# Altium schematic sheet Digital Isolator.SchDoc
size A3; Date: 27.05.2014; DrawnBy: luths8; Organization: BFH; Address1: Bern University of Applied Sciences; Address2: Engineering and Information Technology; Address3: Jlcoweg 1; Address4: CH-3400 Burgdorf; DocumentNumber: 1; Revision: 1.0; SheetNumber: 16; SheetTotal: 17; CurrentDate: 27.05.2014
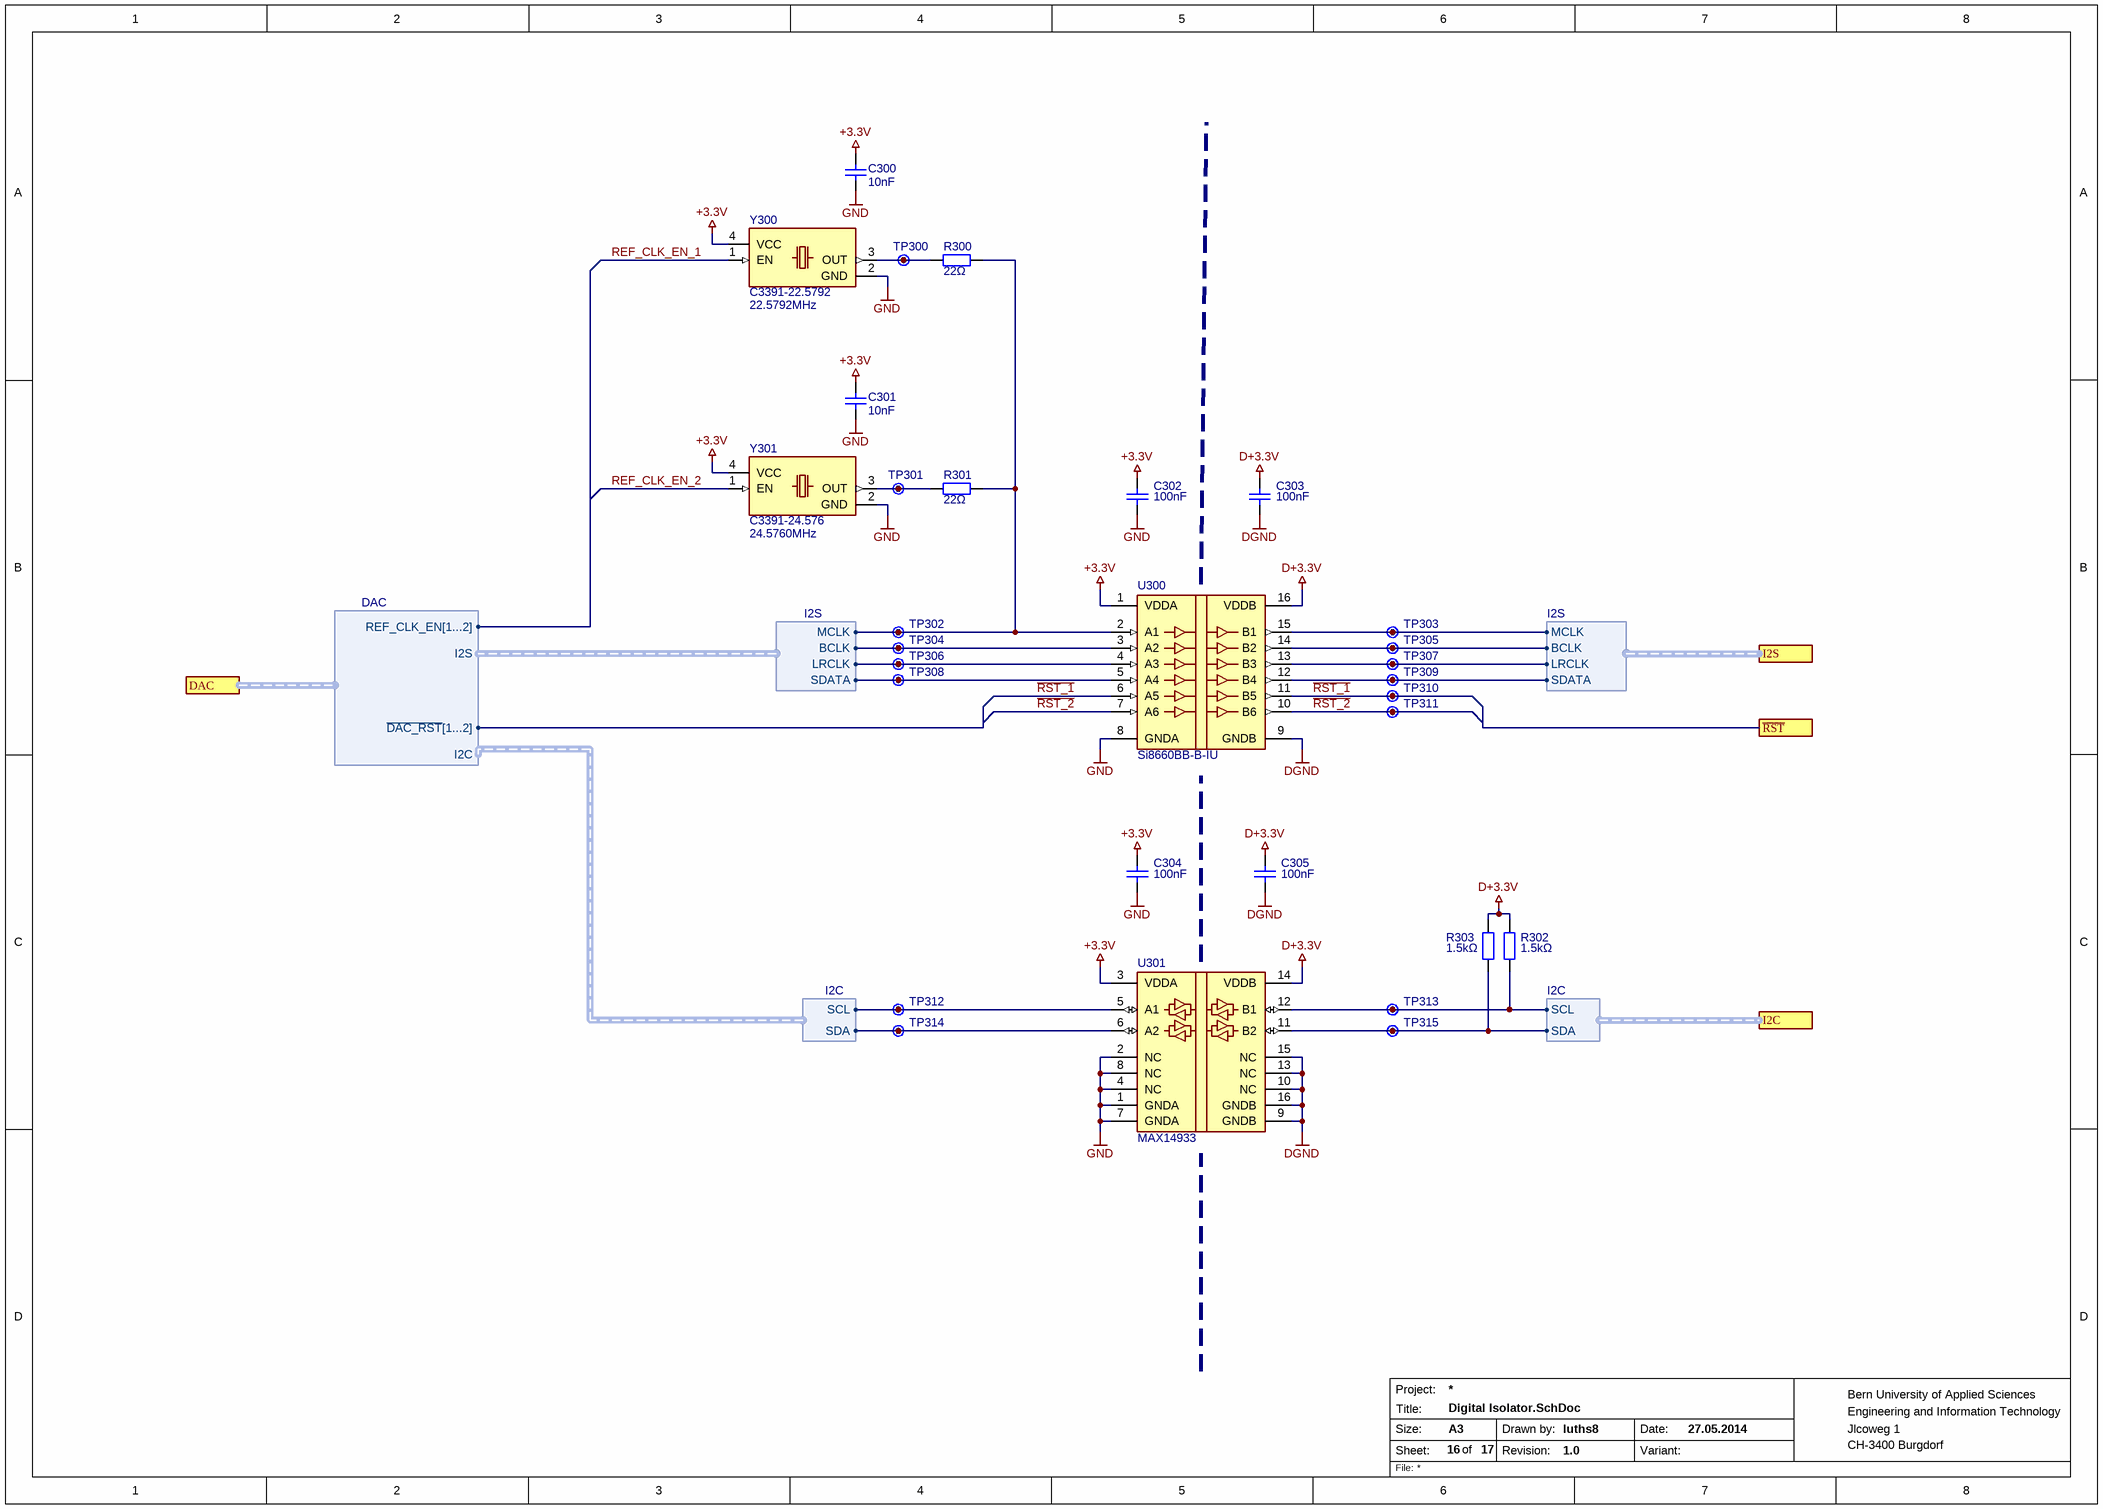
[diagram p0: Digital Isolator.SchDoc]

## Parts
C300  10nF  [SMD0603CAP]
C301  10nF  [SMD0603CAP]
C302  100nF  [SMD0603CAP]
C303  100nF  [SMD0603CAP]
C304  100nF  [SMD0603CAP]
C305  100nF  [SMD0603CAP]
R300  22Ω  [SMD0603RES]
R301  22Ω  [SMD0603RES]
R302  1.5kΩ  [SMD0603RES]
R303  1.5kΩ  [SMD0603RES]
TP300  Testpoint  [TP]  (value not drawn)  (no BOM)
TP301  Testpoint  [TP]  (value not drawn)  (no BOM)
TP302  Testpoint  [TP]  (value not drawn)  (no BOM)
TP303  Testpoint  [TP]  (value not drawn)  (no BOM)
TP304  Testpoint  [TP]  (value not drawn)  (no BOM)
TP305  Testpoint  [TP]  (value not drawn)  (no BOM)
TP306  Testpoint  [TP]  (value not drawn)  (no BOM)
TP307  Testpoint  [TP]  (value not drawn)  (no BOM)
TP308  Testpoint  [TP]  (value not drawn)  (no BOM)
TP309  Testpoint  [TP]  (value not drawn)  (no BOM)
TP310  Testpoint  [TP]  (value not drawn)  (no BOM)
TP311  Testpoint  [TP]  (value not drawn)  (no BOM)
TP312  Testpoint  [TP]  (value not drawn)  (no BOM)
TP313  Testpoint  [TP]  (value not drawn)  (no BOM)
TP314  Testpoint  [TP]  (value not drawn)  (no BOM)
TP315  Testpoint  [TP]  (value not drawn)  (no BOM)
U300  Si8660BB-B-IU  [SOIC16WIDE]
U301  MAX14933  [SOIC16WIDE]
Y300  C3391-22.5792  Frequency: 22.5792MHz  [OSC_CRYSTEK]
Y301  C3391-24.576  Frequency: 24.5760MHz  [OSC_CRYSTEK]

## Ports
DAC (harness DAC), I2C (harness I2C), I2S (harness I2S), ~{RST}

## Harnesses
I2S: MCLK, BCLK, LRCLK, SDATA
I2C: SCL, SDA
DAC: REF_CLK_EN[1...2], I2S, ~{DAC_RST}[1...2], I2C

## Nets
+3.3V: C300.1 C301.1 C302.1 C304.1 U300.1(VDDA) U301.3(VDDA) Y300.4(VCC) Y301.4(VCC)
D+3.3V: C303.1 C305.1 R302.2 R303.2 U300.16(VDDB) U301.14(VDDB)
DGND: C303.2(q) C305.2(q) U300.9(GNDB) U301.9(GNDB) U301.10(NC) U301.13(NC) U301.15(NC) U301.16(GNDB)
GND: C300.2(q) C301.2(q) C302.2(q) C304.2(q) U300.8(GNDA) U301.1(GNDA) U301.2(NC) U301.4(NC) U301.7(GNDA) U301.8(NC) Y300.2(GND) Y301.2(GND)
~{RST_1}: TP310.1 U300.6(A5) U300.11(B5)
~{RST_2}: TP311.1 U300.7(A6) U300.10(B6)
REF_CLK_EN_1: Y300.1(EN)
REF_CLK_EN_2: Y301.1(EN)
NetR300_1: R300.1 TP300.1 Y300.3(OUT)
NetR300_2: R300.2 R301.2 TP302.1 U300.2(A1) ; harness I2S.MCLK
NetR301_1: R301.1 TP301.1 Y301.3(OUT)
NetR302_1: R302.1 TP313.1 U301.12(B1) ; port I2C.SCL
NetR303_1: R303.1 TP315.1 U301.11(B2) ; port I2C.SDA
NetTP303_1: TP303.1 U300.15(B1) ; port I2S.MCLK
NetTP304_1: TP304.1 U300.3(A2) ; harness I2S.BCLK
NetTP305_1: TP305.1 U300.14(B2) ; port I2S.BCLK
NetTP306_1: TP306.1 U300.4(A3) ; harness I2S.LRCLK
NetTP307_1: TP307.1 U300.13(B3) ; port I2S.LRCLK
NetTP308_1: TP308.1 U300.5(A4) ; harness I2S.SDATA
NetTP309_1: TP309.1 U300.12(B4) ; port I2S.SDATA
NetTP312_1: TP312.1 U301.5(A1) ; harness I2C.SCL
NetTP314_1: TP314.1 U301.6(A2) ; harness I2C.SDA

## Notes on the sheet
- Project:
- Size:
- Sheet:
- Title:
- A3
- of
- Drawn by:
- Revision:
- Date:
- Variant:
- File:

## Library data of the parts
C300-C305 = Capacitor Ceramic: Ceramic Capacitor; Voltage: *; Manufacturer Part No.: *
R300-R303 = Resistor: Manufacturer Part No.: *
U300 = Si8660BB-B-IU: Unidirectional digital isolator; Manufacturer Part No.: Si8660BB-B-IU
U301 = MAX14933: Bidirectional digital isolator; Manufacturer Part No.: MAX14933
Y300 Y301 = Oscillator Crystek: HCMOS Oscillator
  Y300: Manufacturer Part No.: C3391-22.5792
  Y301: Manufacturer Part No.: C3391-24.576
TP300-TP315 = Testpoint: Manufacturer Part No.: *